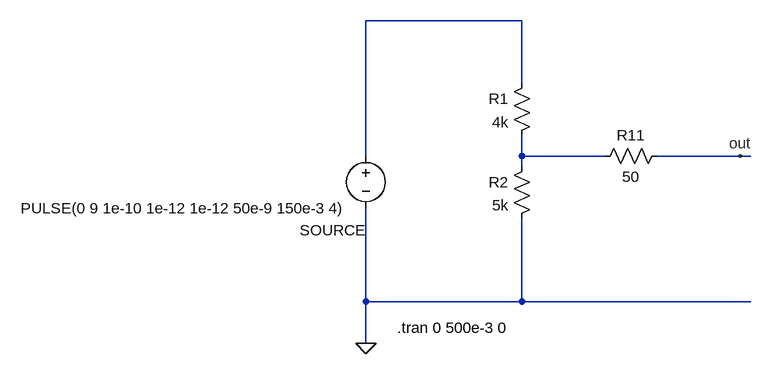
[diagram p0: schematic pulse_source.asc]
pulse_source.asc, the LTspice schematic file:
Version 4
SHEET 1 916 1608
WIRE -1520 336 -1760 336
WIRE -1520 432 -1520 336
WIRE -1760 544 -1760 336
WIRE -1520 544 -1520 512
WIRE -1392 544 -1520 544
WIRE -1184 544 -1312 544
WIRE -1168 544 -1184 544
WIRE -1520 560 -1520 544
WIRE -1760 768 -1760 624
WIRE -1520 768 -1520 640
WIRE -1520 768 -1760 768
WIRE -1168 768 -1520 768
WIRE -1760 832 -1760 768
FLAG -1760 832 0
FLAG -1184 544 out
SYMBOL voltage -1760 528 M0
WINDOW 123 0 0 Left 0
WINDOW 39 24 132 Left 0
WINDOW 0 0 130 Left 0
SYMATTR InstName SOURCE
SYMATTR Value PULSE(0 9 1e-10 1e-12 1e-12 50e-9 150e-3 4)
SYMBOL res -1504 544 M0
SYMATTR InstName R2
SYMATTR Value 5k
SYMBOL res -1504 416 M0
SYMATTR InstName R1
SYMATTR Value 4k
SYMBOL res -1296 528 R90
WINDOW 0 0 56 VBottom 0
WINDOW 3 32 56 VTop 0
SYMATTR InstName R11
SYMATTR Value 50
TEXT -1712 808 Left 0 !.tran 0 500e-3 0

The netlist it stands for:
* pulse_source.asc
V§SOURCE N001 0 PULSE(0 9 1e-10 1e-12 1e-12 50e-9 150e-3 4)
R2 N002 0 5k
R1 N001 N002 4k
R11 out N002 50
.tran 0 500e-3 0
.backanno
.end